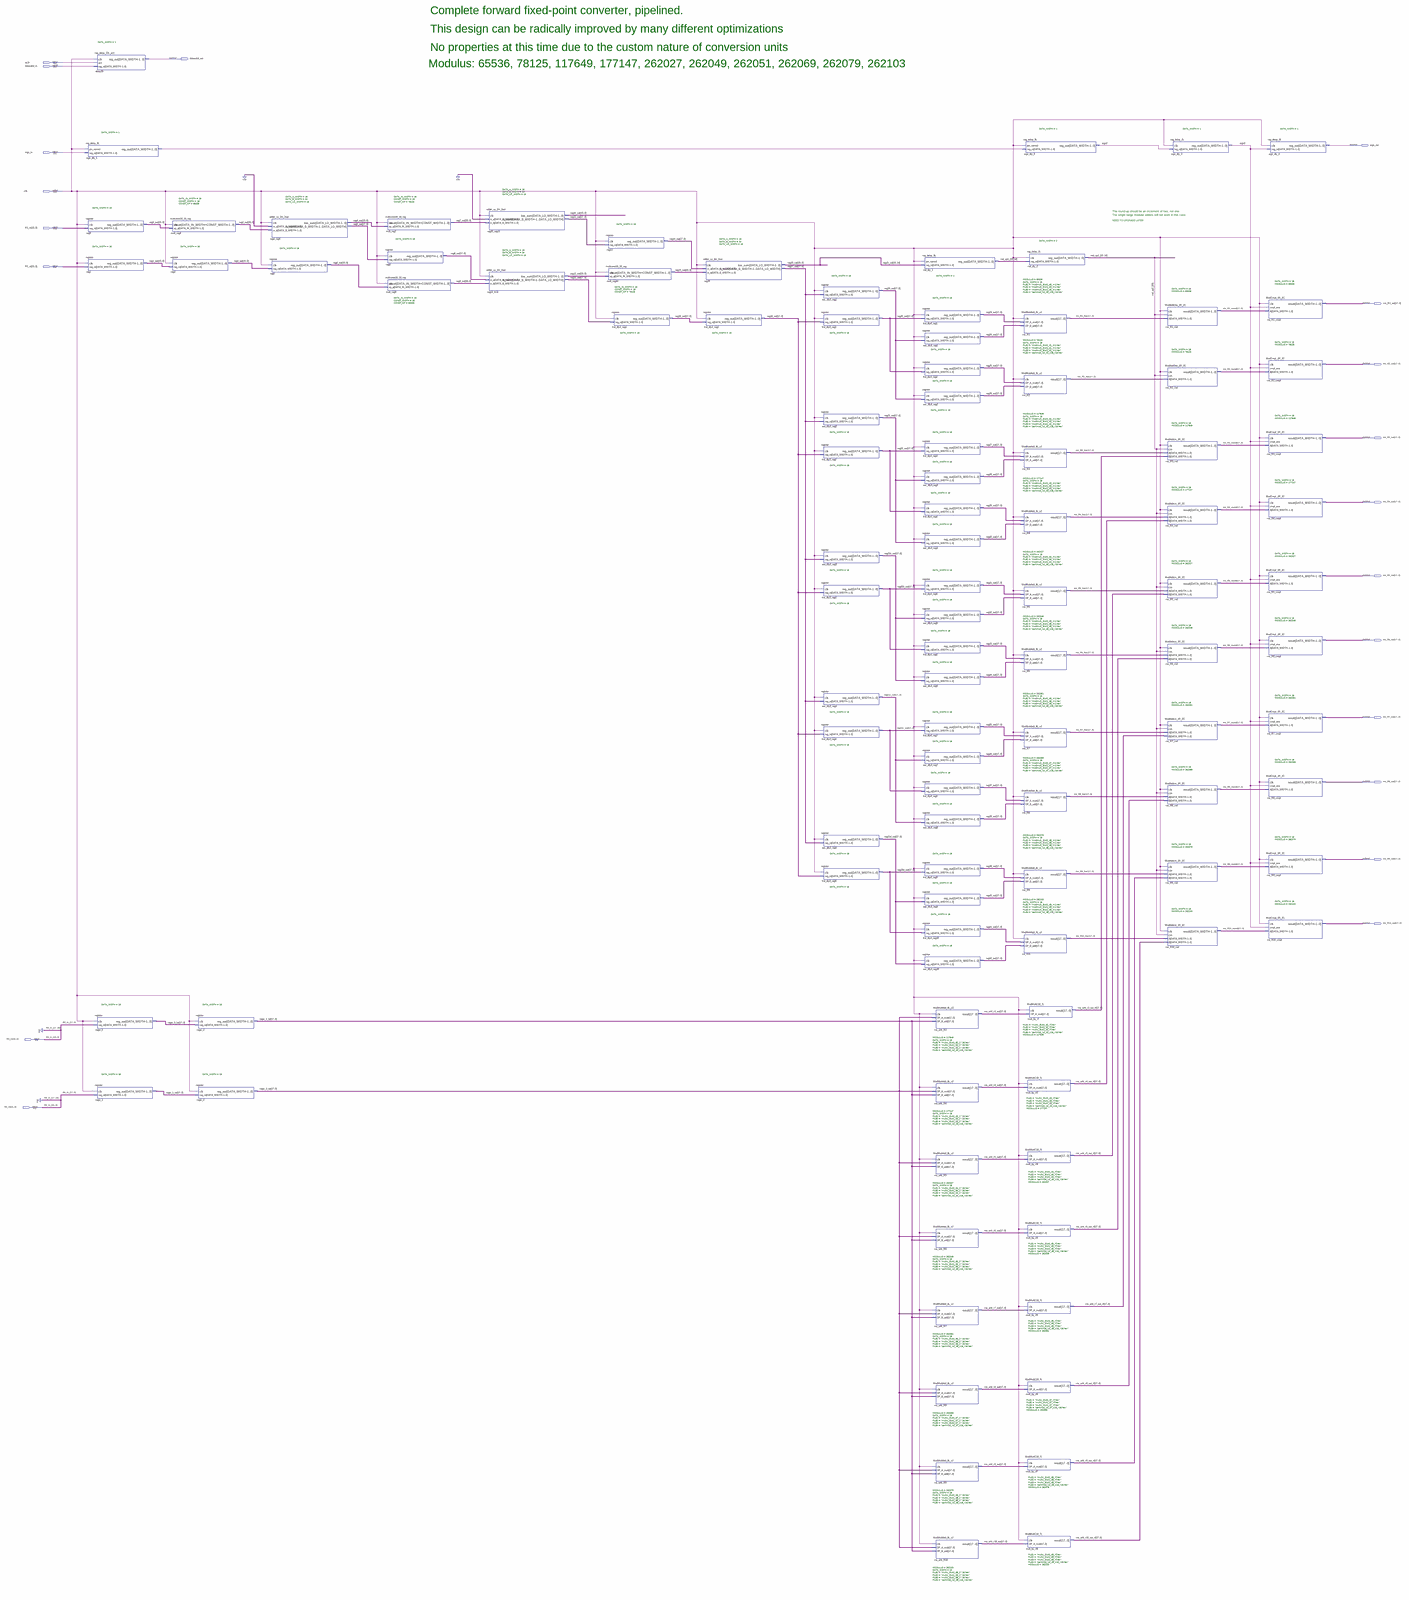
[diagram p0: schematic sheet, whole]
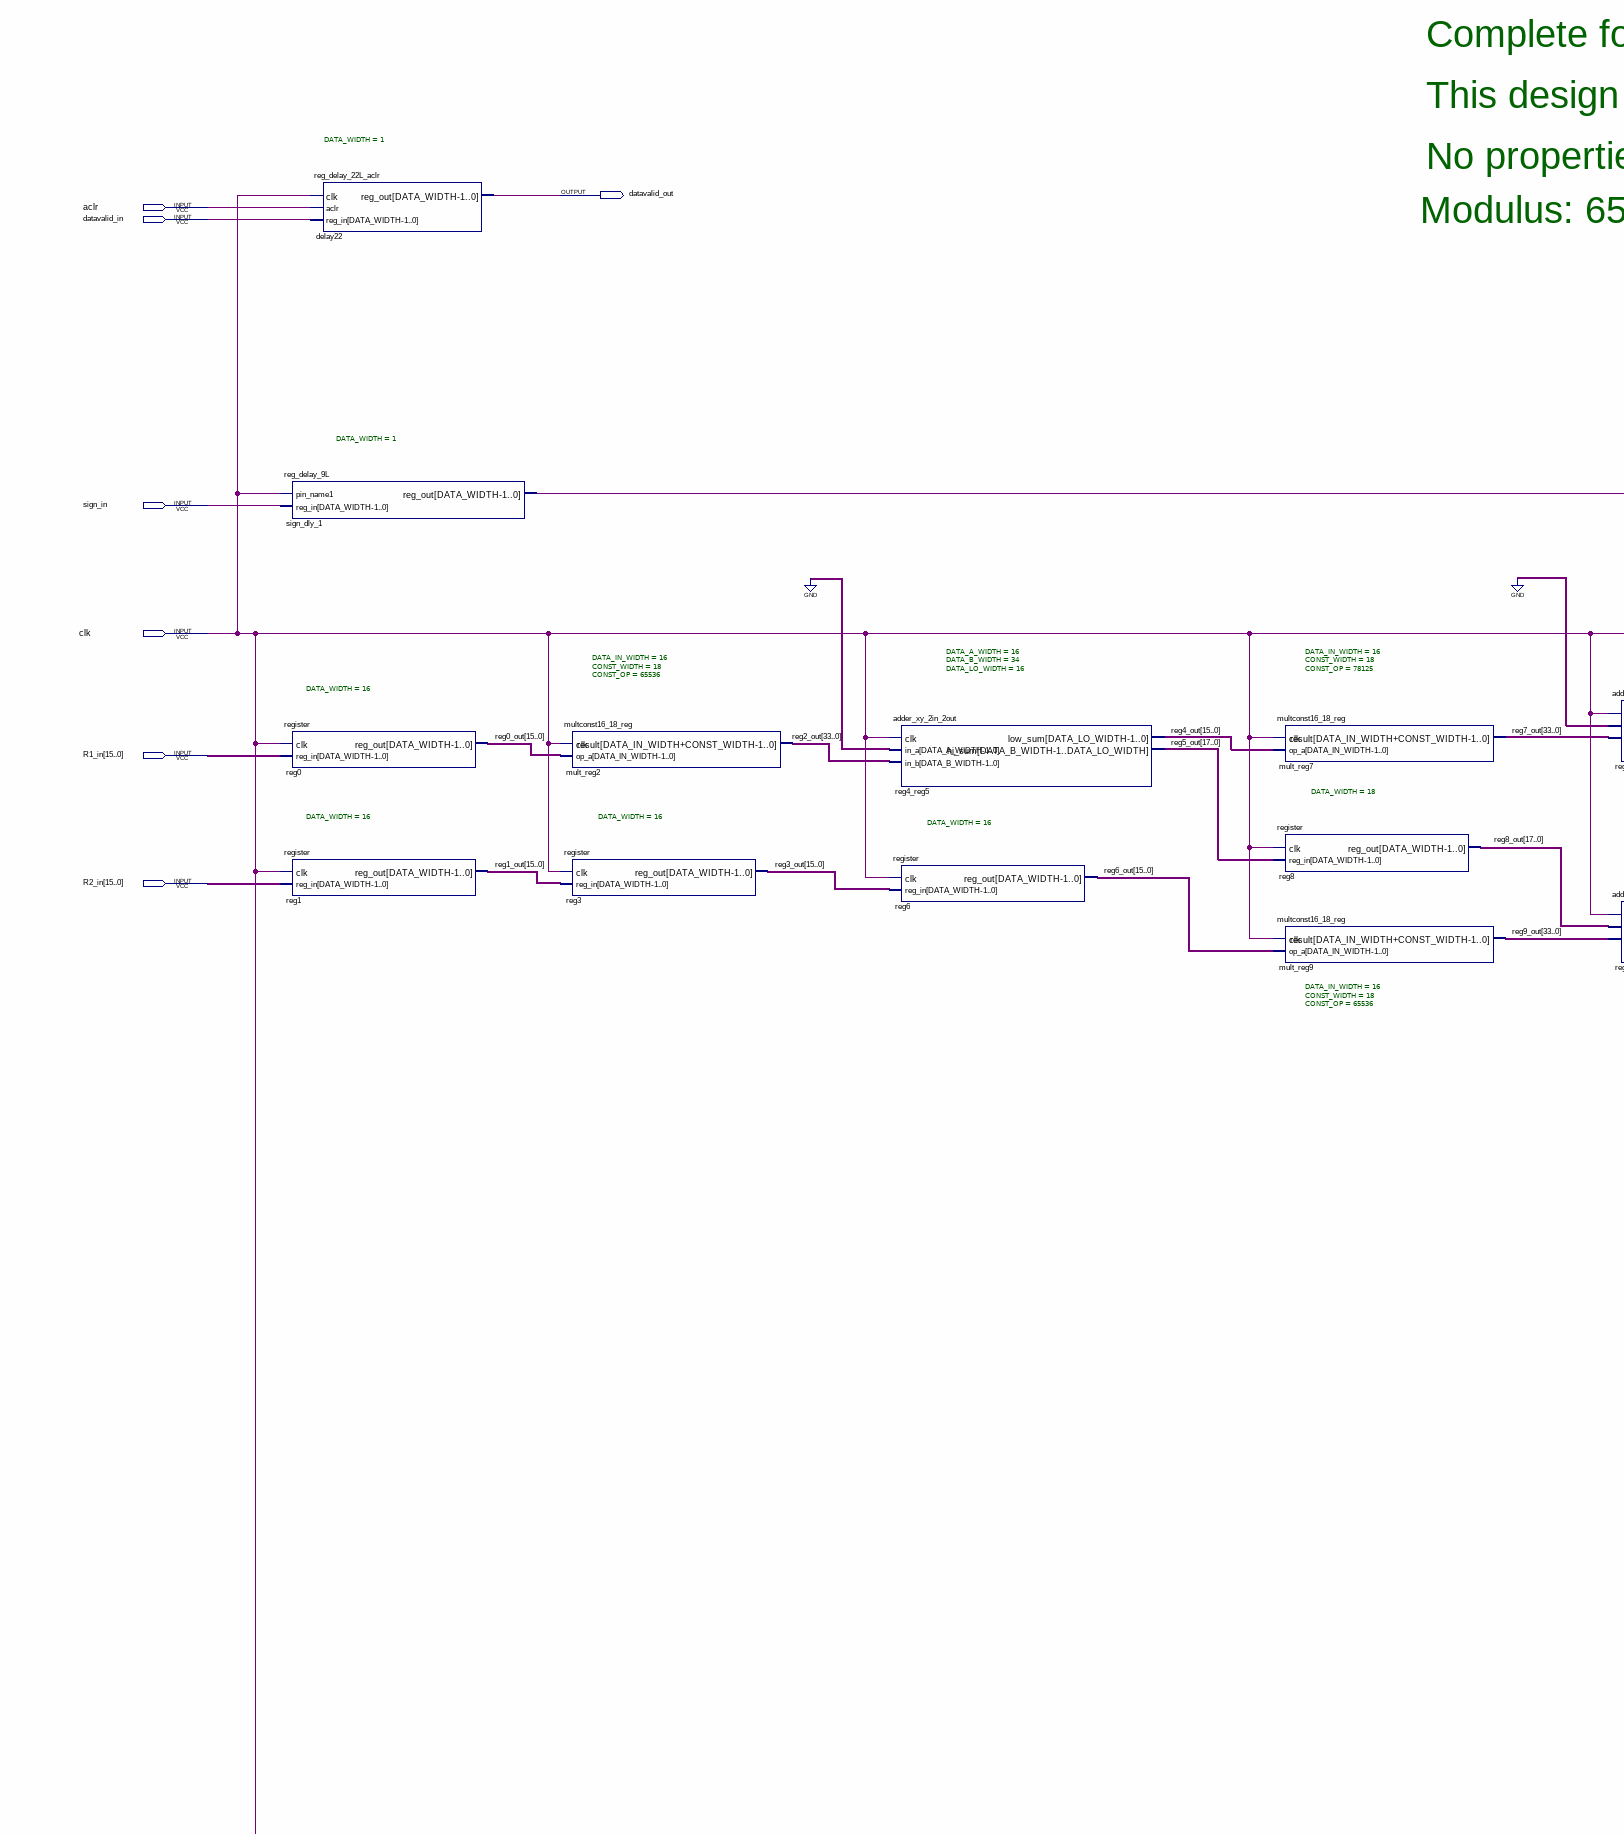
[diagram p1: schematic sheet, upper left part]
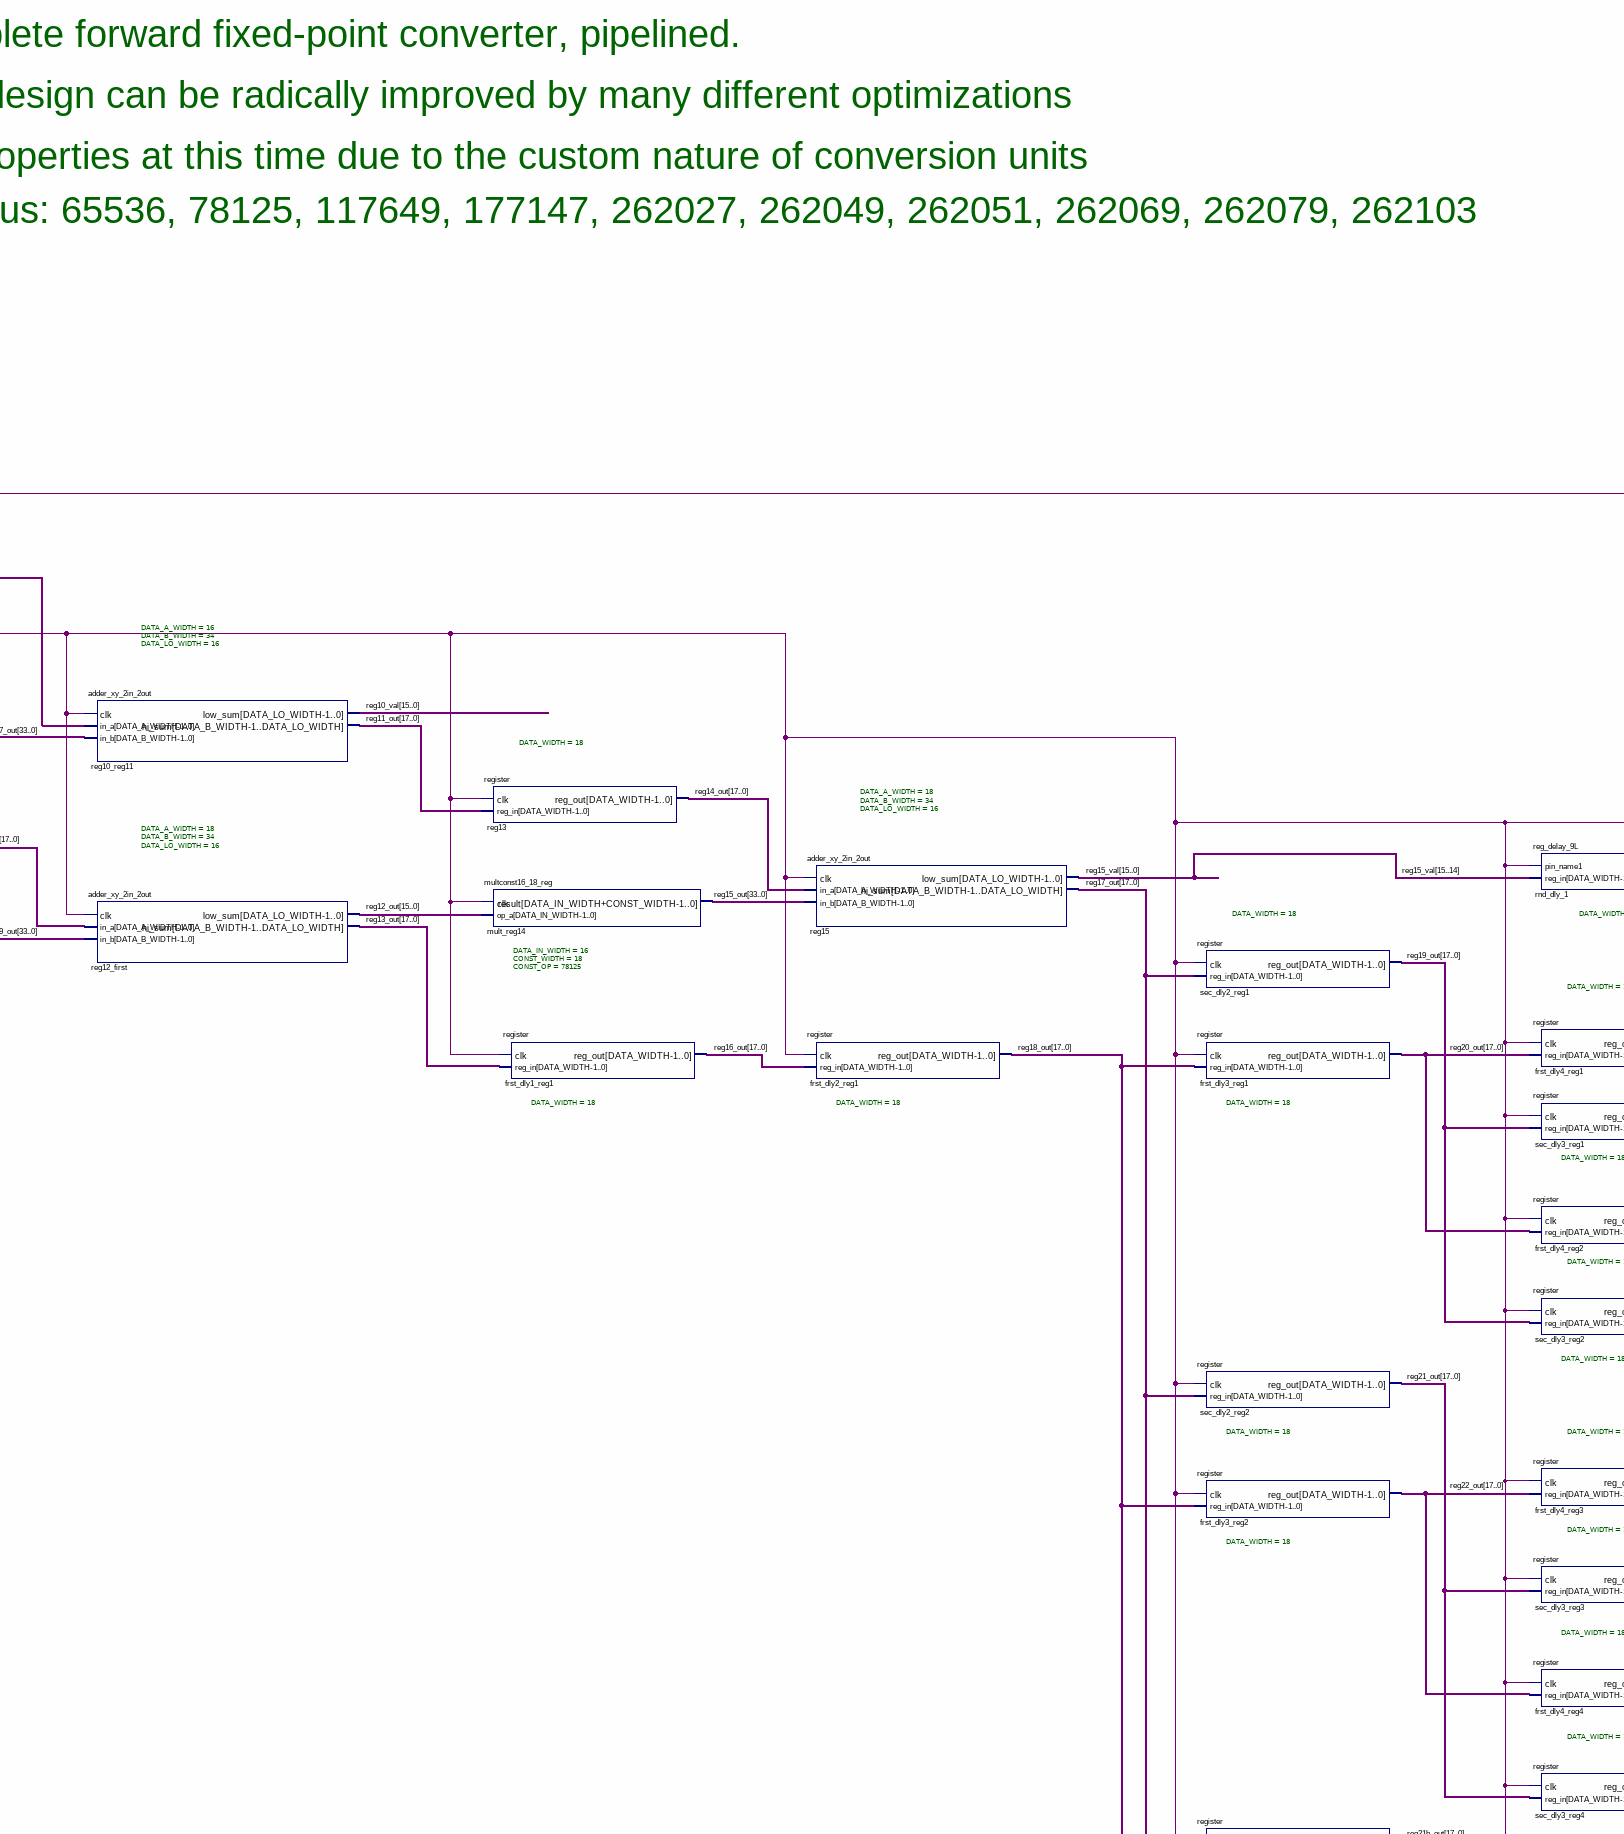
[diagram p2: schematic sheet, upper centre part]
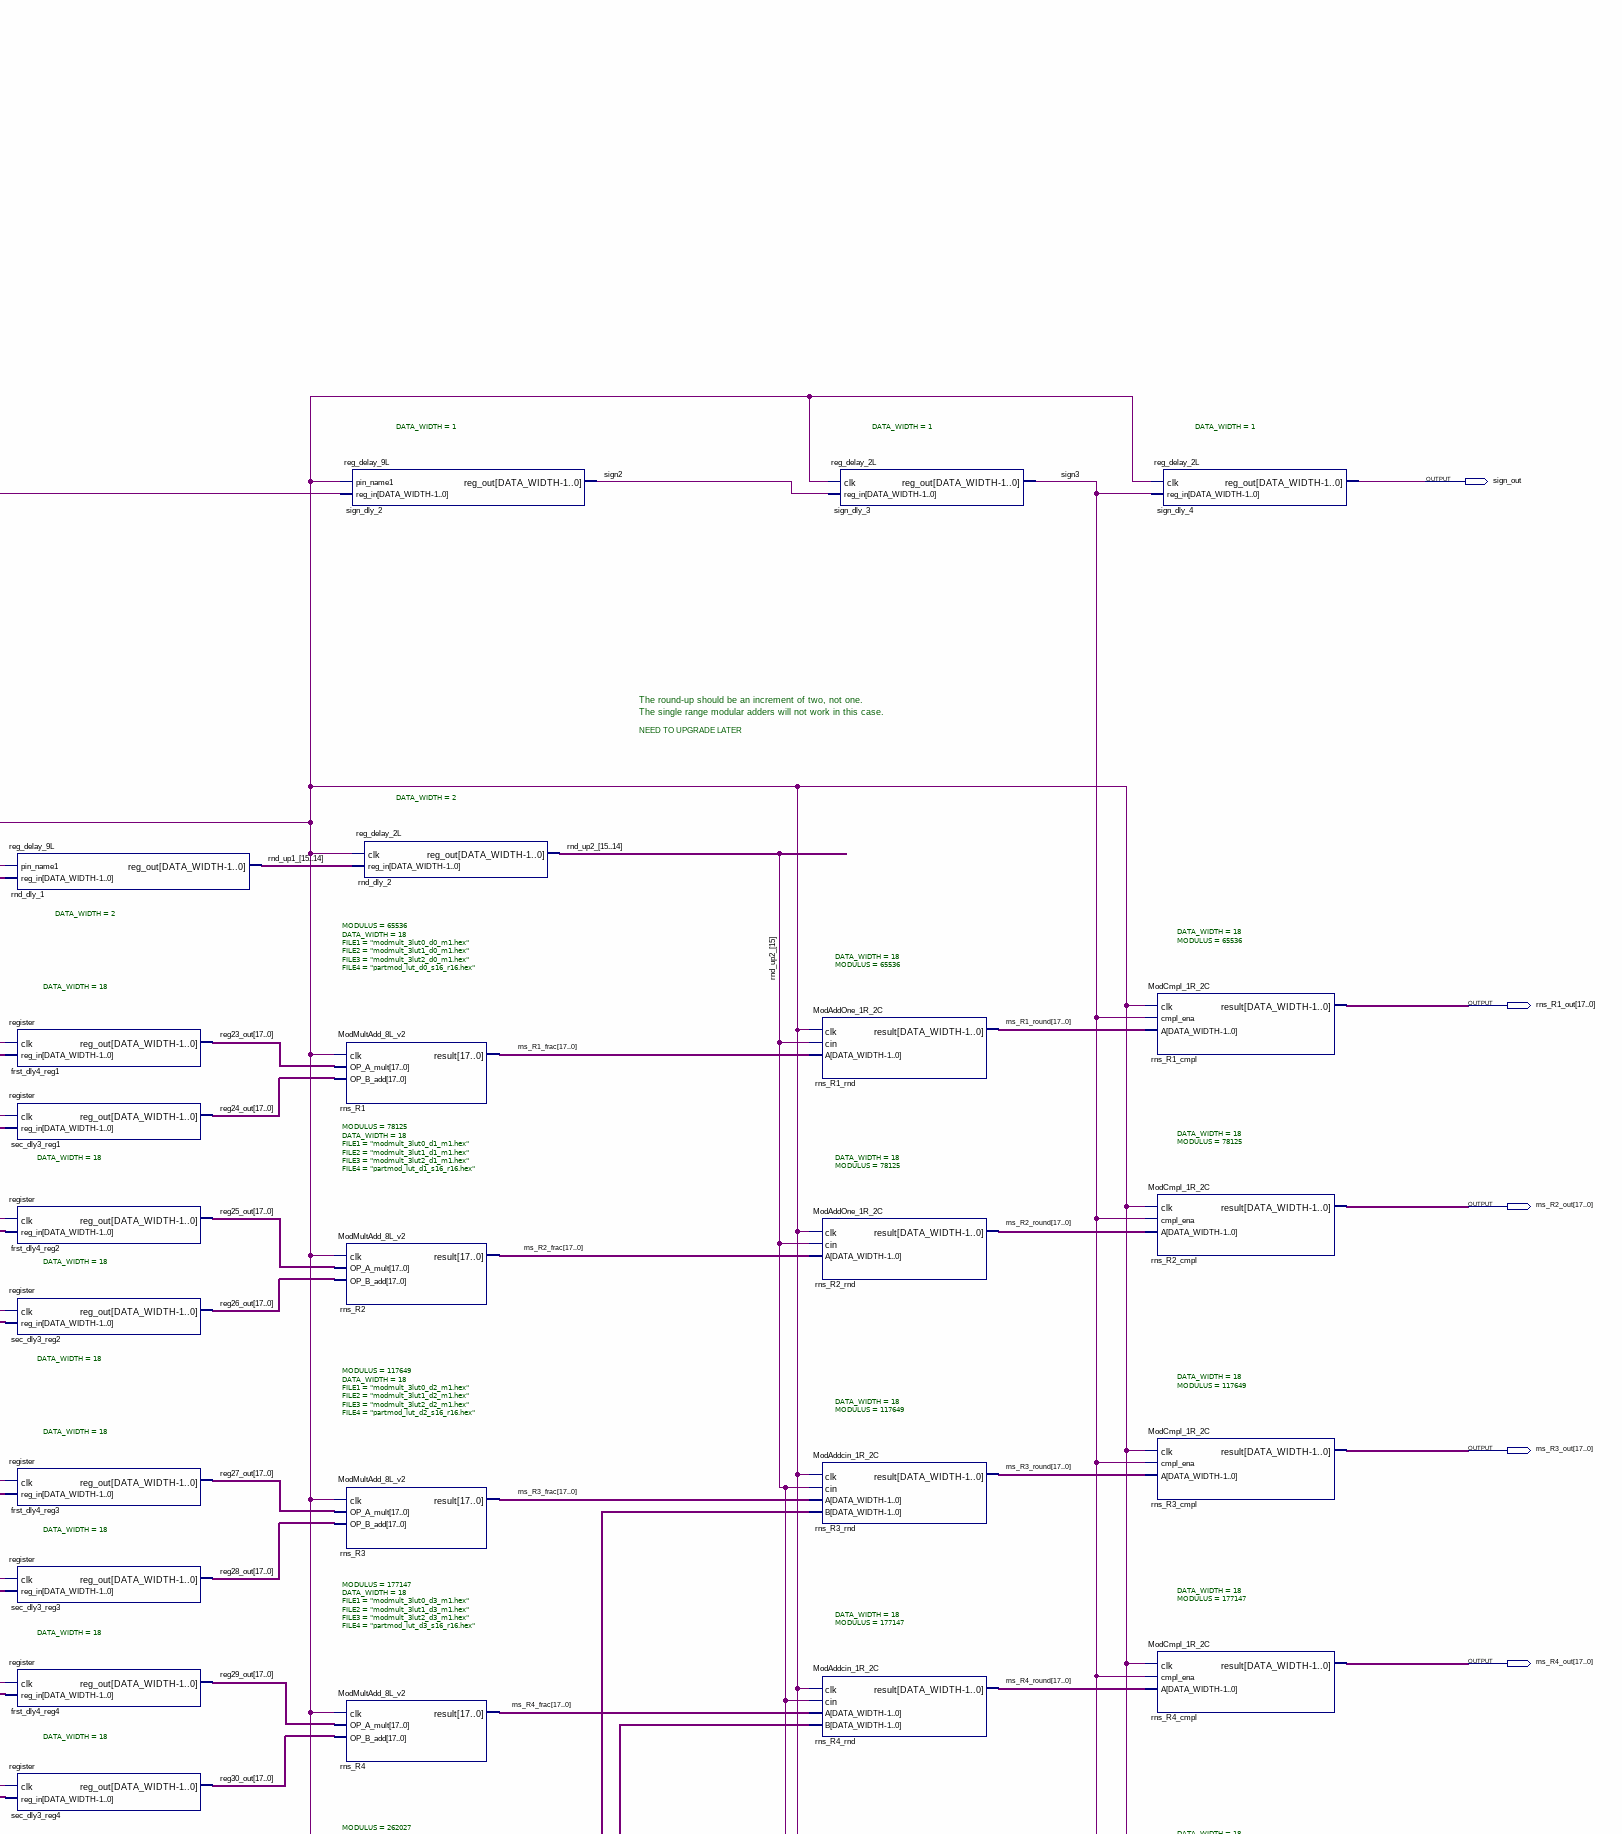
[diagram p3: schematic sheet, upper right part]
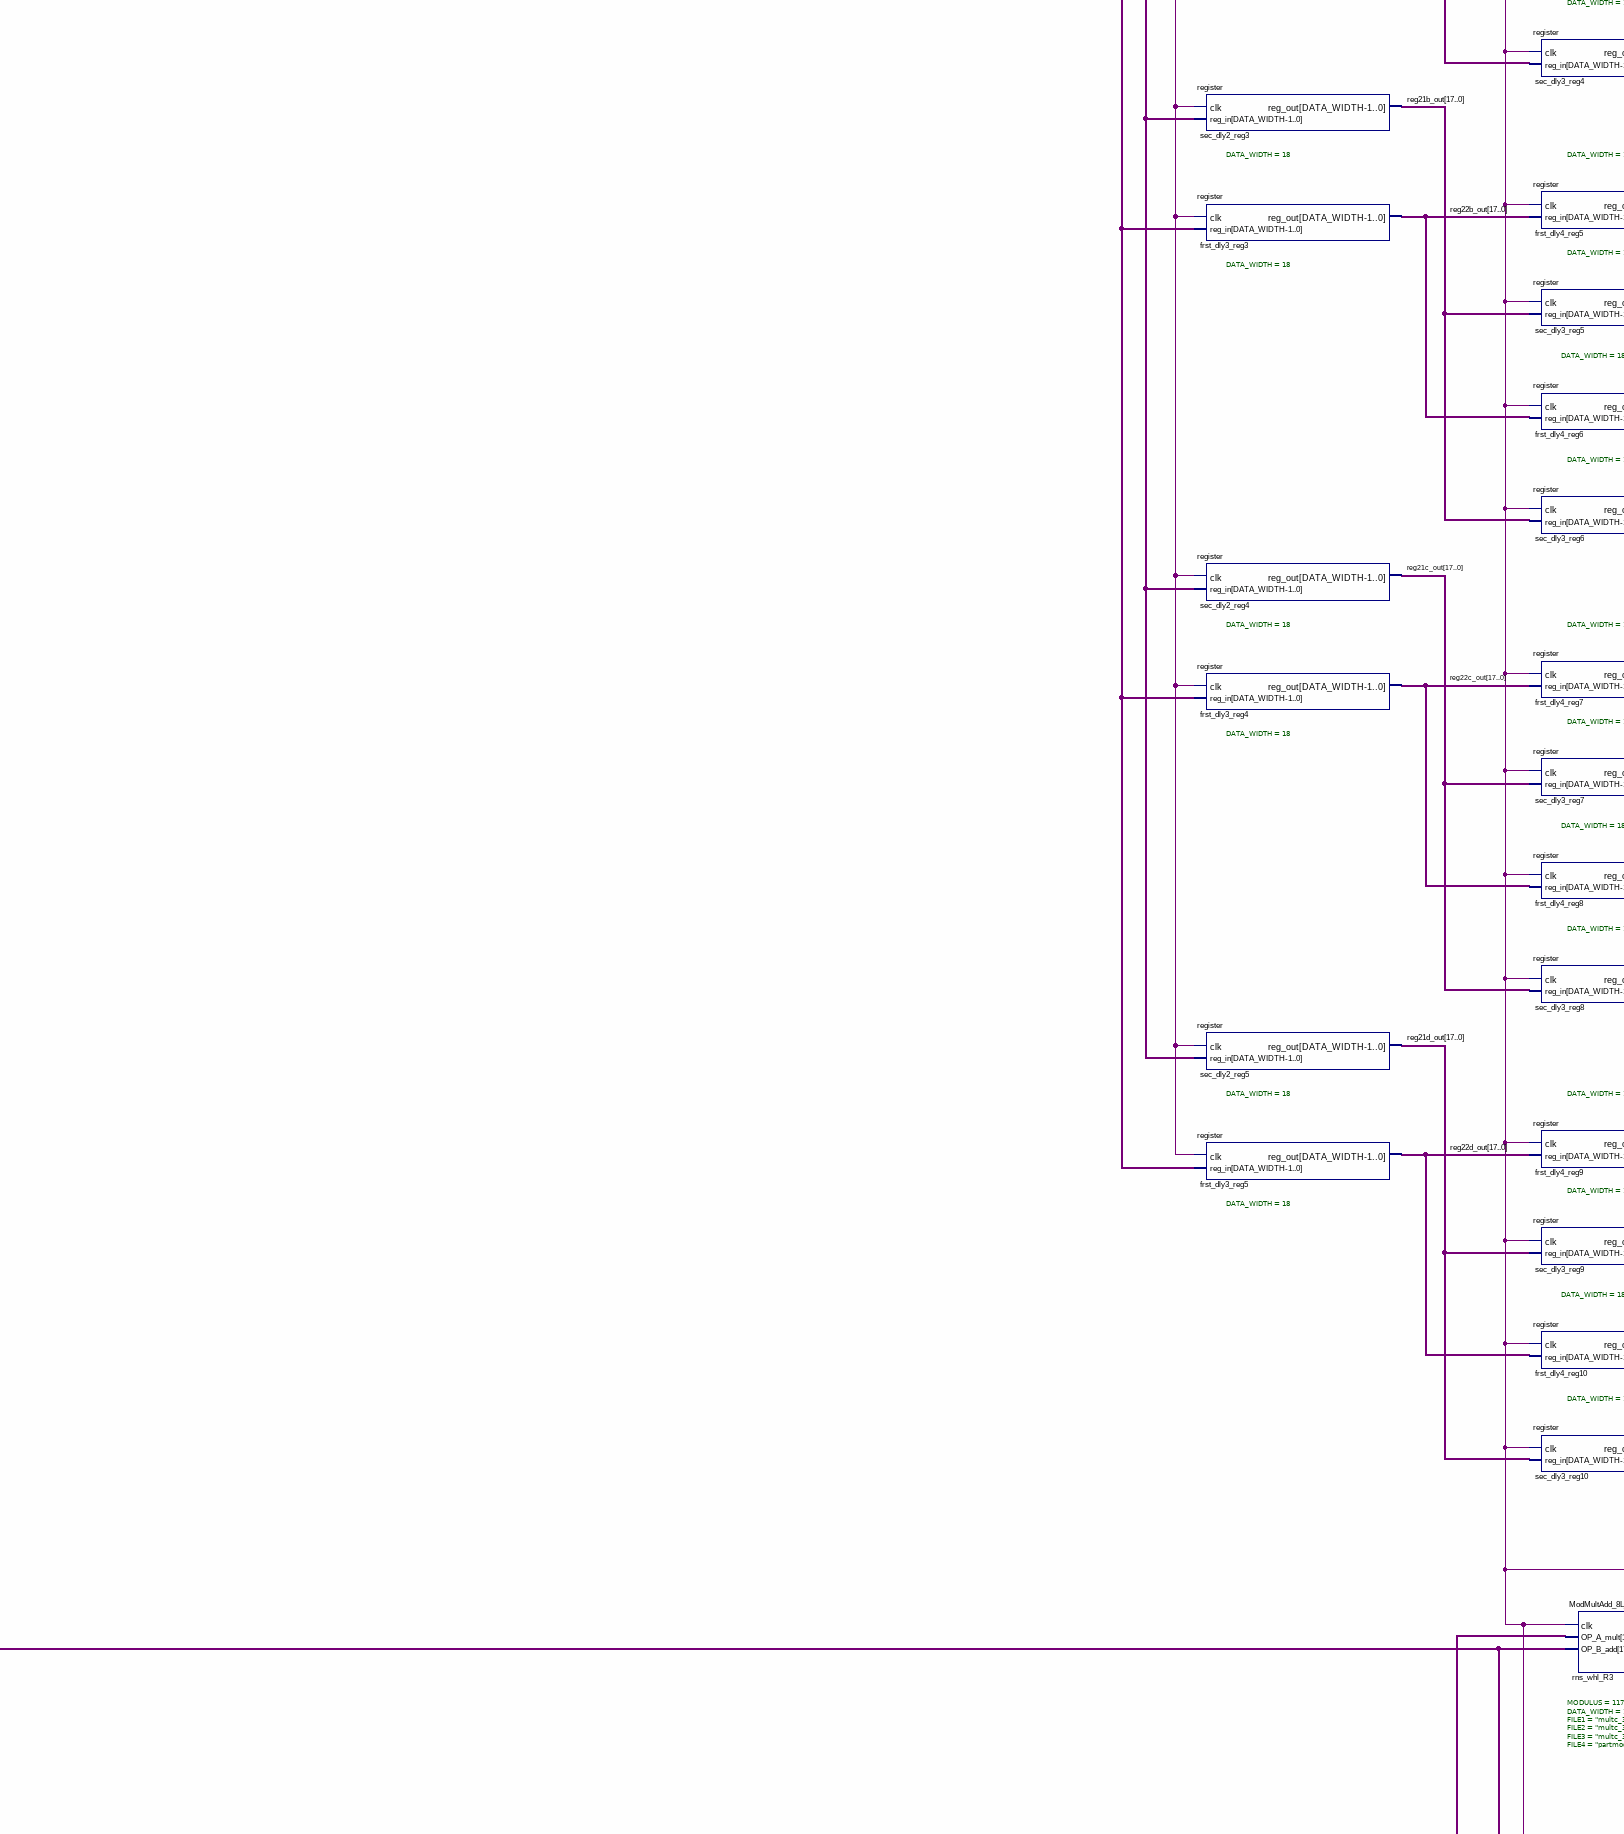
[diagram p4: schematic sheet, middle centre part]
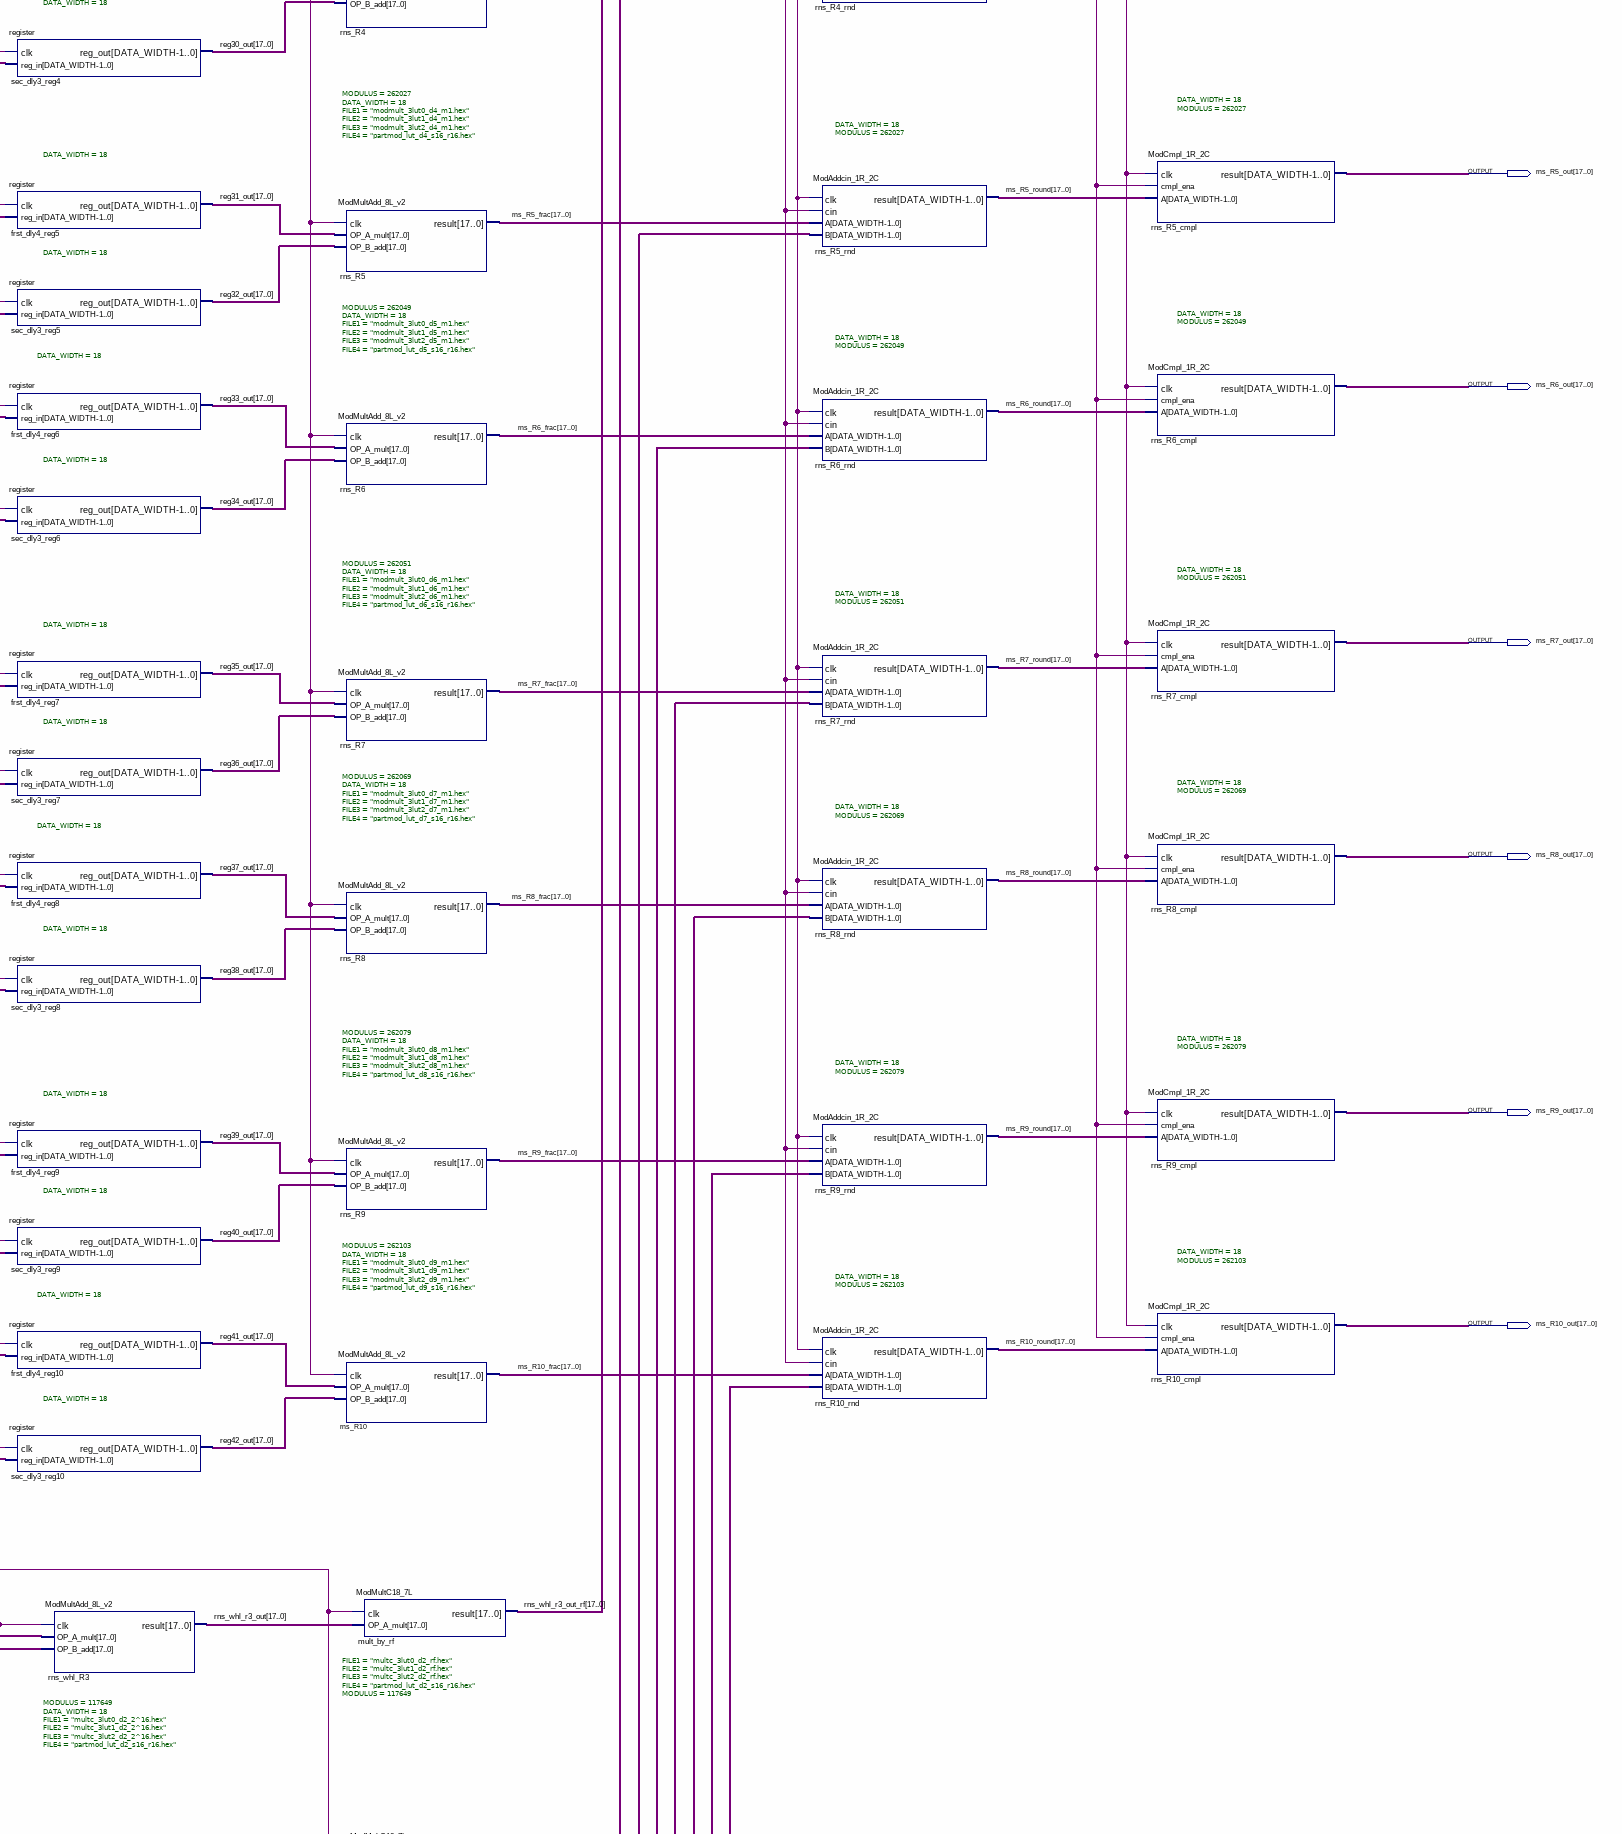
[diagram p5: schematic sheet, middle right part]
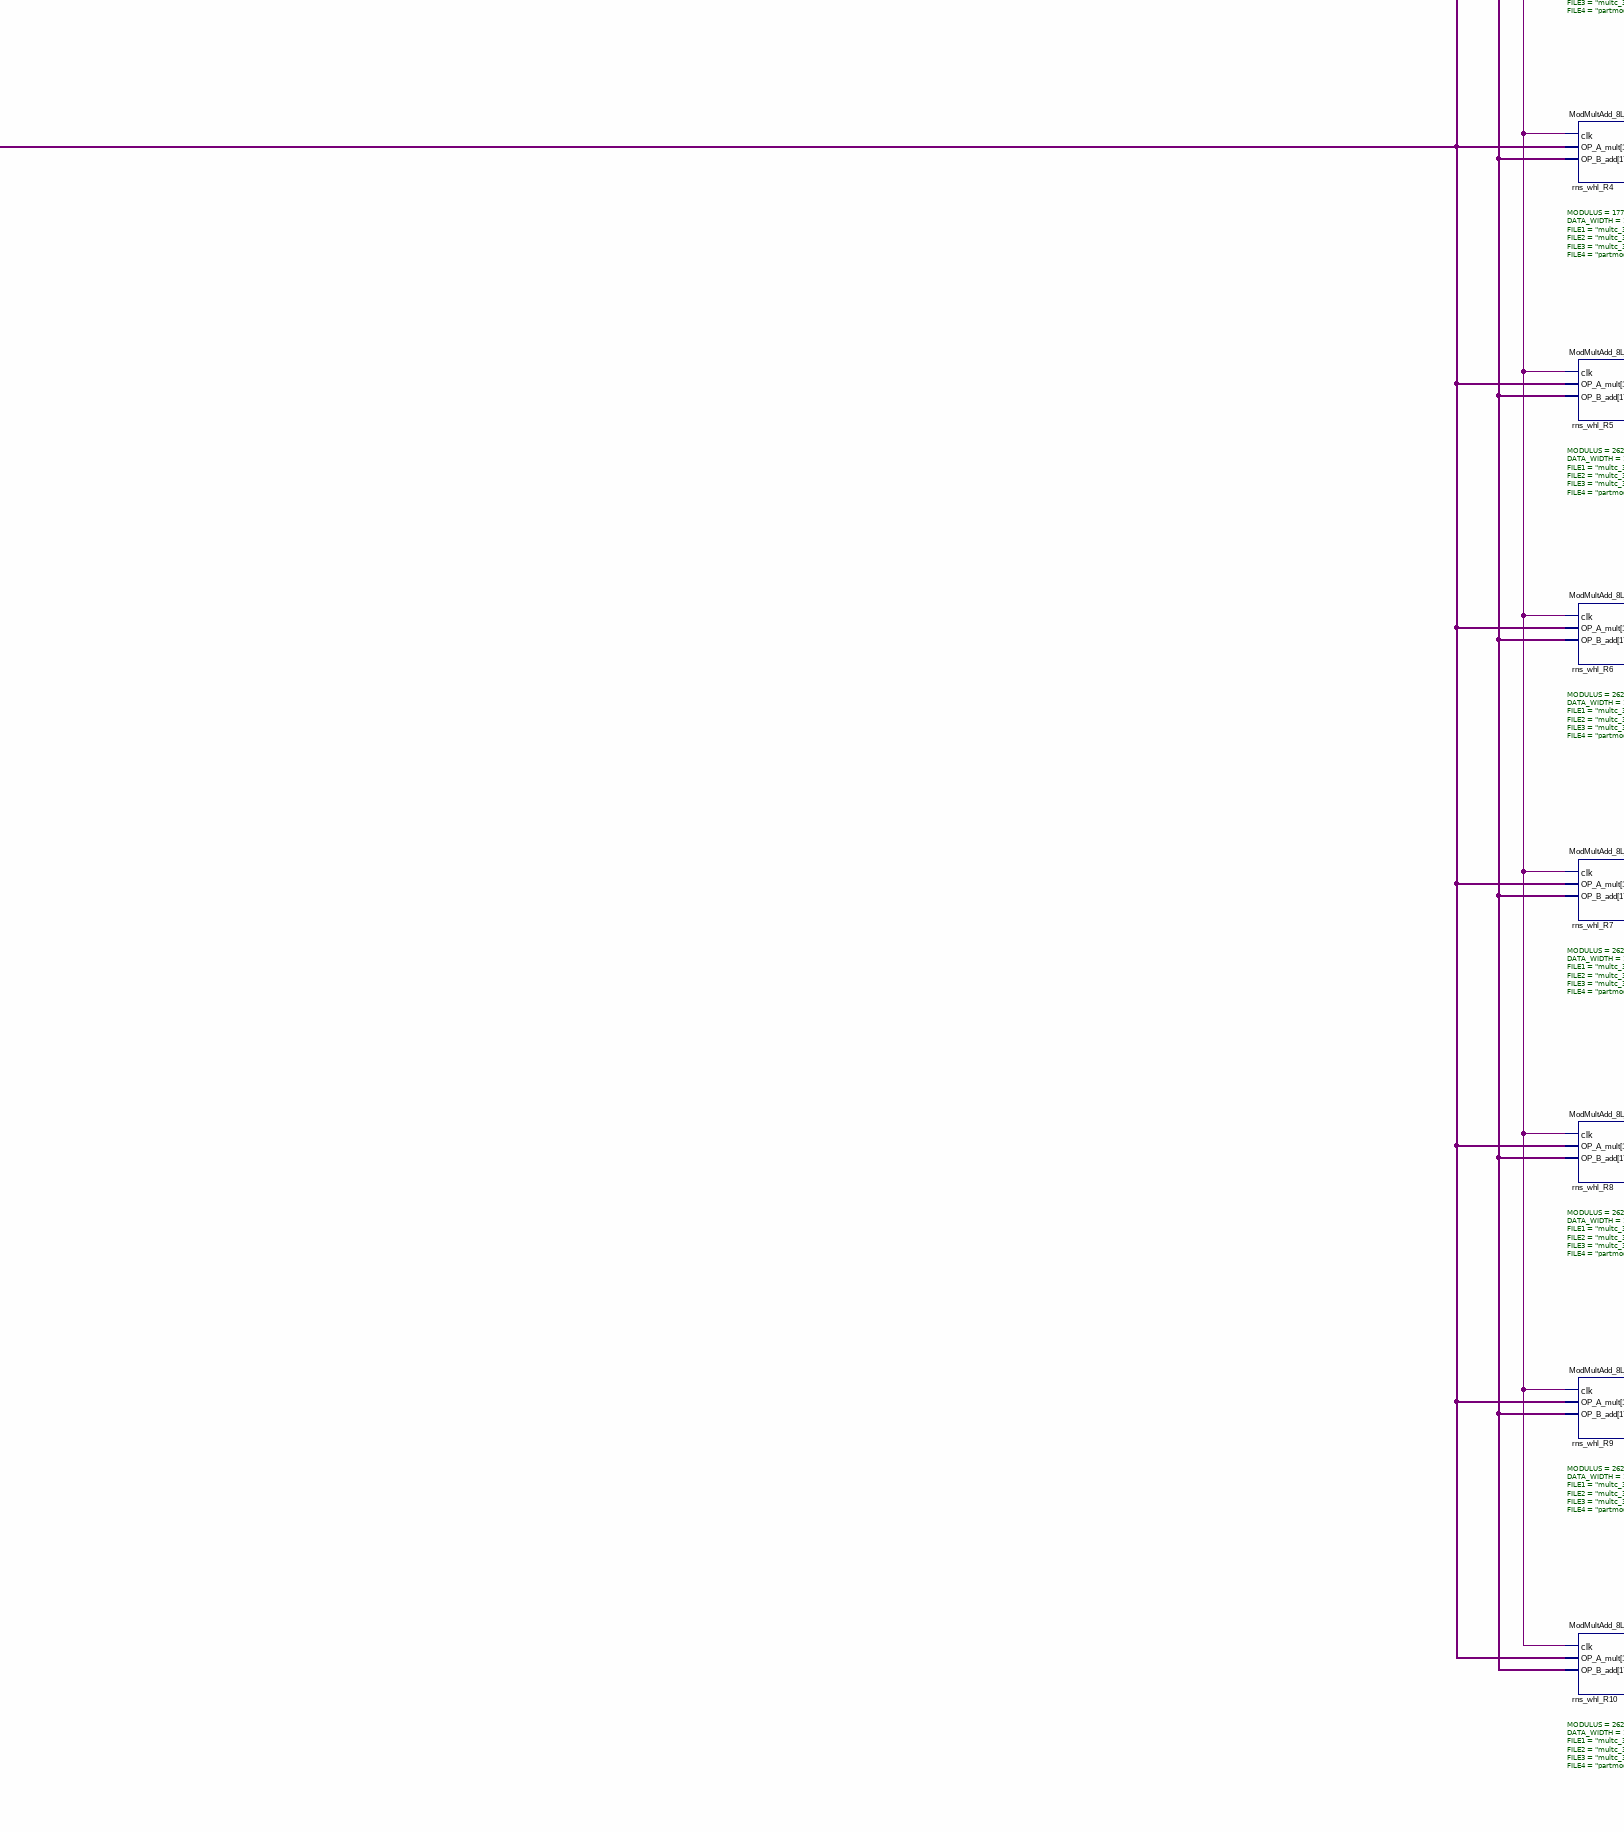
[diagram p6: schematic sheet, lower centre part]
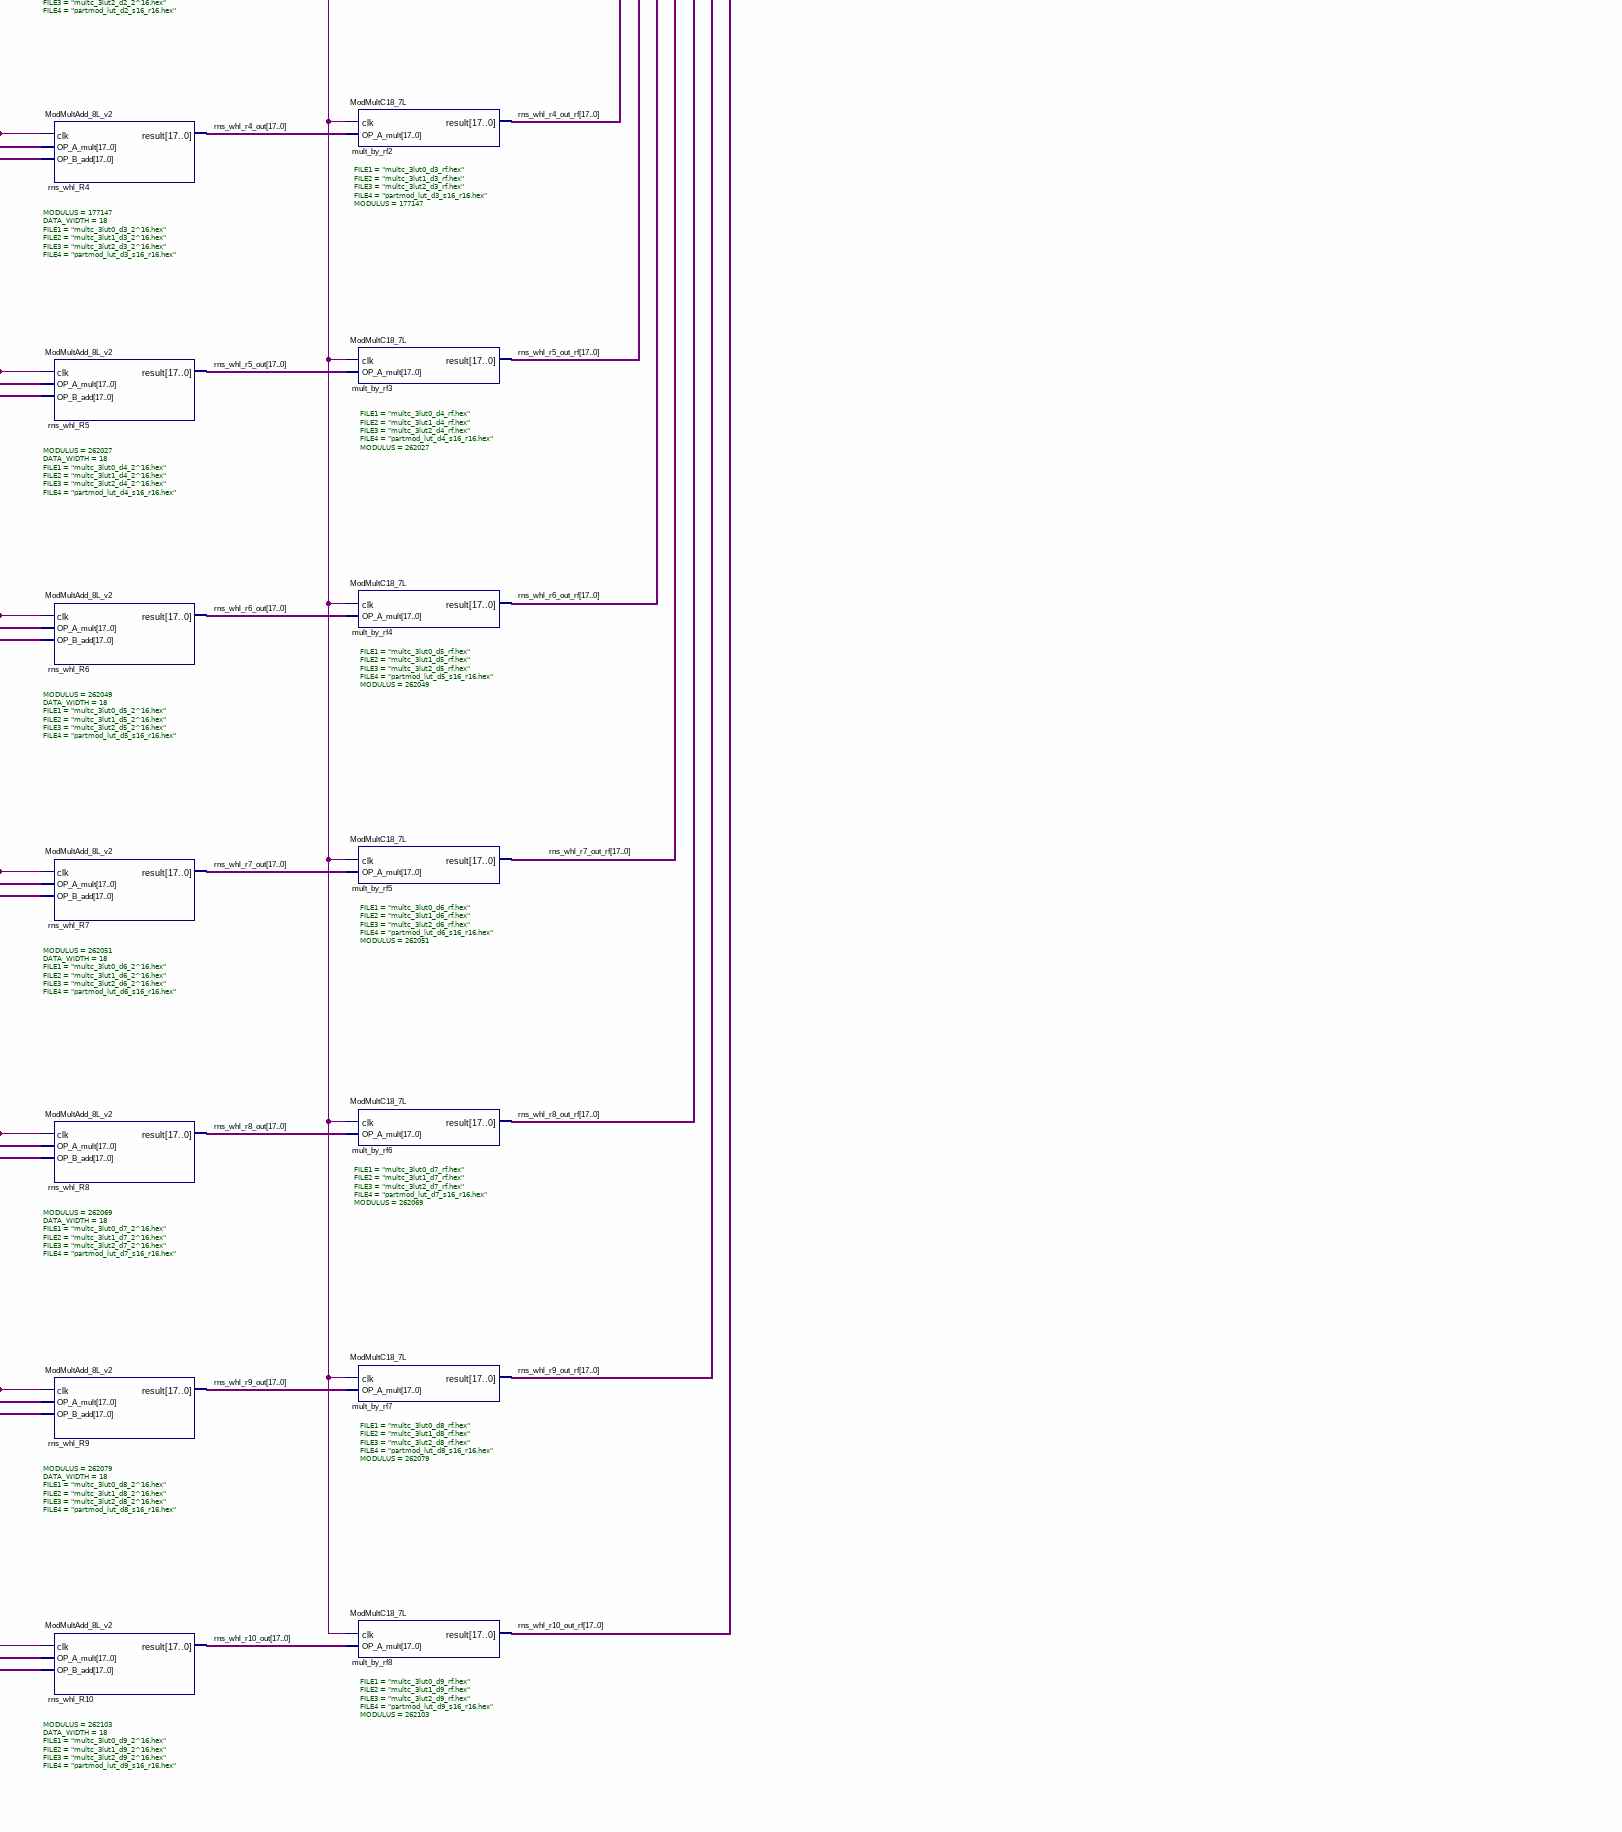
[diagram p7: schematic sheet, lower right part]
// Quartus schematic FFracConv4x16_10x18_dval.bdf as structural Verilog: 103 symbols, 20 pins
module FFracConv4x16_10x18_dval (
  input  aclr,
  input  datavalid_in,
  input  sign_in,
  input  clk,
  input  [15:0] R1_in,
  input  [15:0] R2_in,
  input  [15:0] R3_in,
  input  [15:0] R4_in,
  output datavalid_out,
  output sign_out,
  output [17:0] rns_R1_out,
  output [17:0] rns_R2_out,
  output [17:0] rns_R3_out,
  output [17:0] rns_R4_out,
  output [17:0] rns_R5_out,
  output [17:0] rns_R6_out,
  output [17:0] rns_R7_out,
  output [17:0] rns_R8_out,
  output [17:0] rns_R9_out,
  output [17:0] rns_R10_out
);

  wire sign2, sign3, sign_dly_1_reg_out;
  wire [15:0] reg0_out, reg1_out, reg3_out, reg4_out, reg6_out, reg10_val, reg12_out, reg15_val;
  wire [15:14] rnd_up1_, rnd_up2_;
  wire [17:0] reg5_out, reg8_out, reg11_out, reg13_out, reg14_out, reg16_out, reg17_out, reg18_out,
       reg19_out, reg20_out, reg21_out, reg21b_out, reg21c_out, reg21d_out, reg22_out, reg22b_out,
       reg22c_out, reg22d_out, reg23_out, reg24_out, reg25_out, reg26_out, reg27_out, reg28_out, reg29_out,
       reg30_out, reg31_out, reg32_out, reg33_out, reg34_out, reg35_out, reg36_out, reg37_out, reg38_out,
       reg39_out, reg40_out, reg41_out, reg42_out, regw_0_lat, regw_1_lat, regw_2_lat, regw_3_lat,
       rns_R1_frac, rns_R1_round, rns_R2_frac, rns_R2_round, rns_R3_frac, rns_R3_round, rns_R4_frac,
       rns_R4_round, rns_R5_frac, rns_R5_round, rns_R6_frac, rns_R6_round, rns_R7_frac, rns_R7_round,
       rns_R8_frac, rns_R8_round, rns_R9_frac, rns_R9_round, rns_R10_frac, rns_R10_round, rns_whl_r3_out,
       rns_whl_r3_out_rf, rns_whl_r4_out, rns_whl_r4_out_rf, rns_whl_r5_out, rns_whl_r5_out_rf,
       rns_whl_r6_out, rns_whl_r6_out_rf, rns_whl_r7_out, rns_whl_r7_out_rf, rns_whl_r8_out,
       rns_whl_r8_out_rf, rns_whl_r9_out, rns_whl_r9_out_rf, rns_whl_r10_out, rns_whl_r10_out_rf;
  wire [33:0] reg2_out, reg7_out, reg9_out, reg15_out;

  reg_delay_9L #(.DATA_WIDTH(1)) sign_dly_1 (.pin_name1(clk), .reg_in(sign_in), .reg_out(sign_dly_1_reg_out));
  register #(.DATA_WIDTH(16)) reg0 (.clk(clk), .reg_in(R1_in), .reg_out(reg0_out));
  register #(.DATA_WIDTH(16)) reg1 (.clk(clk), .reg_in(R2_in), .reg_out(reg1_out));
  reg_delay_22L_aclr #(.DATA_WIDTH(1)) delay22 (.clk(clk), .aclr(aclr), .reg_in(datavalid_in), .reg_out(datavalid_out));
  register #(.DATA_WIDTH(18)) regw_0 (.clk(clk), .reg_in({2'b00, R3_in}), .reg_out(regw_0_lat));
  register #(.DATA_WIDTH(18)) regw_1 (.clk(clk), .reg_in({2'b00, R4_in}), .reg_out(regw_1_lat));
  multconst16_18_reg #(.DATA_IN_WIDTH(16), .CONST_WIDTH(18), .CONST_OP(65536)) mult_reg2 (
    .clk(clk), .op_a(reg0_out), .result(reg2_out));
  register #(.DATA_WIDTH(16)) reg3 (.clk(clk), .reg_in(reg1_out), .reg_out(reg3_out));
  register #(.DATA_WIDTH(18)) regw_2 (.clk(clk), .reg_in(regw_0_lat), .reg_out(regw_2_lat));
  register #(.DATA_WIDTH(18)) regw_3 (.clk(clk), .reg_in(regw_1_lat), .reg_out(regw_3_lat));
  adder_xy_2in_2out #(.DATA_A_WIDTH(16), .DATA_B_WIDTH(34), .DATA_LO_WIDTH(16)) reg4_reg5 (
    .clk(clk), .in_a({16{1'b0}}), .in_b(reg2_out), .low_sum(reg4_out), .hi_sum(reg5_out));
  register #(.DATA_WIDTH(16)) reg6 (.clk(clk), .reg_in(reg3_out), .reg_out(reg6_out));
  multconst16_18_reg #(.DATA_IN_WIDTH(16), .CONST_WIDTH(18), .CONST_OP(78125)) mult_reg7 (
    .clk(clk), .op_a(reg4_out), .result(reg7_out));
  register #(.DATA_WIDTH(18)) reg8 (.clk(clk), .reg_in(reg5_out), .reg_out(reg8_out));
  multconst16_18_reg #(.DATA_IN_WIDTH(16), .CONST_WIDTH(18), .CONST_OP(65536)) mult_reg9 (
    .clk(clk), .op_a(reg6_out), .result(reg9_out));
  adder_xy_2in_2out #(.DATA_A_WIDTH(16), .DATA_B_WIDTH(34), .DATA_LO_WIDTH(16)) reg10_reg11 (
    .clk(clk), .in_a({16{1'b0}}), .in_b(reg7_out), .low_sum(reg10_val), .hi_sum(reg11_out));
  adder_xy_2in_2out #(.DATA_A_WIDTH(18), .DATA_B_WIDTH(34), .DATA_LO_WIDTH(16)) reg12_first (
    .clk(clk), .in_a(reg8_out), .in_b(reg9_out), .low_sum(reg12_out), .hi_sum(reg13_out));
  register #(.DATA_WIDTH(18)) reg13 (.clk(clk), .reg_in(reg11_out), .reg_out(reg14_out));
  multconst16_18_reg #(.DATA_IN_WIDTH(16), .CONST_WIDTH(18), .CONST_OP(78125)) mult_reg14 (
    .clk(clk), .op_a(reg12_out), .result(reg15_out));
  register #(.DATA_WIDTH(18)) frst_dly1_reg1 (.clk(clk), .reg_in(reg13_out), .reg_out(reg16_out));
  adder_xy_2in_2out #(.DATA_A_WIDTH(18), .DATA_B_WIDTH(34), .DATA_LO_WIDTH(16)) reg15 (
    .clk(clk), .in_a(reg14_out), .in_b(reg15_out), .low_sum(reg15_val), .hi_sum(reg17_out));
  register #(.DATA_WIDTH(18)) frst_dly2_reg1 (.clk(clk), .reg_in(reg16_out), .reg_out(reg18_out));
  register #(.DATA_WIDTH(18)) sec_dly2_reg1 (.clk(clk), .reg_in(reg17_out), .reg_out(reg19_out));
  register #(.DATA_WIDTH(18)) frst_dly3_reg1 (.clk(clk), .reg_in(reg18_out), .reg_out(reg20_out));
  register #(.DATA_WIDTH(18)) sec_dly2_reg2 (.clk(clk), .reg_in(reg17_out), .reg_out(reg21_out));
  register #(.DATA_WIDTH(18)) frst_dly3_reg2 (.clk(clk), .reg_in(reg18_out), .reg_out(reg22_out));
  register #(.DATA_WIDTH(18)) sec_dly2_reg3 (.clk(clk), .reg_in(reg17_out), .reg_out(reg21b_out));
  register #(.DATA_WIDTH(18)) frst_dly3_reg3 (.clk(clk), .reg_in(reg18_out), .reg_out(reg22b_out));
  register #(.DATA_WIDTH(18)) sec_dly2_reg4 (.clk(clk), .reg_in(reg17_out), .reg_out(reg21c_out));
  register #(.DATA_WIDTH(18)) frst_dly3_reg4 (.clk(clk), .reg_in(reg18_out), .reg_out(reg22c_out));
  register #(.DATA_WIDTH(18)) sec_dly2_reg5 (.clk(clk), .reg_in(reg17_out), .reg_out(reg21d_out));
  register #(.DATA_WIDTH(18)) frst_dly3_reg5 (.clk(clk), .reg_in(reg18_out), .reg_out(reg22d_out));
  reg_delay_9L #(.DATA_WIDTH(2)) rnd_dly_1 (.pin_name1(clk), .reg_in(reg15_val[15:14]), .reg_out(rnd_up1_));
  register #(.DATA_WIDTH(18)) frst_dly4_reg1 (.clk(clk), .reg_in(reg20_out), .reg_out(reg23_out));
  register #(.DATA_WIDTH(18)) sec_dly3_reg1 (.clk(clk), .reg_in(reg19_out), .reg_out(reg24_out));
  register #(.DATA_WIDTH(18)) frst_dly4_reg2 (.clk(clk), .reg_in(reg20_out), .reg_out(reg25_out));
  register #(.DATA_WIDTH(18)) sec_dly3_reg2 (.clk(clk), .reg_in(reg19_out), .reg_out(reg26_out));
  register #(.DATA_WIDTH(18)) frst_dly4_reg3 (.clk(clk), .reg_in(reg22_out), .reg_out(reg27_out));
  register #(.DATA_WIDTH(18)) sec_dly3_reg3 (.clk(clk), .reg_in(reg21_out), .reg_out(reg28_out));
  register #(.DATA_WIDTH(18)) frst_dly4_reg4 (.clk(clk), .reg_in(reg22_out), .reg_out(reg29_out));
  register #(.DATA_WIDTH(18)) sec_dly3_reg4 (.clk(clk), .reg_in(reg21_out), .reg_out(reg30_out));
  register #(.DATA_WIDTH(18)) frst_dly4_reg5 (.clk(clk), .reg_in(reg22b_out), .reg_out(reg31_out));
  register #(.DATA_WIDTH(18)) sec_dly3_reg5 (.clk(clk), .reg_in(reg21b_out), .reg_out(reg32_out));
  register #(.DATA_WIDTH(18)) frst_dly4_reg6 (.clk(clk), .reg_in(reg22b_out), .reg_out(reg33_out));
  register #(.DATA_WIDTH(18)) sec_dly3_reg6 (.clk(clk), .reg_in(reg21b_out), .reg_out(reg34_out));
  register #(.DATA_WIDTH(18)) frst_dly4_reg7 (.clk(clk), .reg_in(reg22c_out), .reg_out(reg35_out));
  register #(.DATA_WIDTH(18)) sec_dly3_reg7 (.clk(clk), .reg_in(reg21c_out), .reg_out(reg36_out));
  register #(.DATA_WIDTH(18)) frst_dly4_reg8 (.clk(clk), .reg_in(reg22c_out), .reg_out(reg37_out));
  register #(.DATA_WIDTH(18)) sec_dly3_reg8 (.clk(clk), .reg_in(reg21c_out), .reg_out(reg38_out));
  register #(.DATA_WIDTH(18)) frst_dly4_reg9 (.clk(clk), .reg_in(reg22d_out), .reg_out(reg39_out));
  register #(.DATA_WIDTH(18)) sec_dly3_reg9 (.clk(clk), .reg_in(reg21d_out), .reg_out(reg40_out));
  register #(.DATA_WIDTH(18)) frst_dly4_reg10 (.clk(clk), .reg_in(reg22d_out), .reg_out(reg41_out));
  register #(.DATA_WIDTH(18)) sec_dly3_reg10 (.clk(clk), .reg_in(reg21d_out), .reg_out(reg42_out));
  ModMultAdd_8L_v2 #(.MODULUS(117649), .DATA_WIDTH(18), .FILE1("multc_3lut0_d2_2^16.hex"), .FILE2("multc_3lut1_d2_2^16.hex"), .FILE3("multc_3lut2_d2_2^16.hex"), .FILE4("partmod_lut_d2_s16_r16.hex")) rns_whl_R3 (
    .clk(clk), .OP_A_mult(regw_3_lat), .OP_B_add(regw_2_lat), .result(rns_whl_r3_out));
  ModMultAdd_8L_v2 #(.MODULUS(177147), .DATA_WIDTH(18), .FILE1("multc_3lut0_d3_2^16.hex"), .FILE2("multc_3lut1_d3_2^16.hex"), .FILE3("multc_3lut2_d3_2^16.hex"), .FILE4("partmod_lut_d3_s16_r16.hex")) rns_whl_R4 (
    .clk(clk), .OP_A_mult(regw_3_lat), .OP_B_add(regw_2_lat), .result(rns_whl_r4_out));
  ModMultAdd_8L_v2 #(.MODULUS(262027), .DATA_WIDTH(18), .FILE1("multc_3lut0_d4_2^16.hex"), .FILE2("multc_3lut1_d4_2^16.hex"), .FILE3("multc_3lut2_d4_2^16.hex"), .FILE4("partmod_lut_d4_s16_r16.hex")) rns_whl_R5 (
    .clk(clk), .OP_A_mult(regw_3_lat), .OP_B_add(regw_2_lat), .result(rns_whl_r5_out));
  ModMultAdd_8L_v2 #(.MODULUS(262049), .DATA_WIDTH(18), .FILE1("multc_3lut0_d5_2^16.hex"), .FILE2("multc_3lut1_d5_2^16.hex"), .FILE3("multc_3lut2_d5_2^16.hex"), .FILE4("partmod_lut_d5_s16_r16.hex")) rns_whl_R6 (
    .clk(clk), .OP_A_mult(regw_3_lat), .OP_B_add(regw_2_lat), .result(rns_whl_r6_out));
  ModMultAdd_8L_v2 #(.MODULUS(262051), .DATA_WIDTH(18), .FILE1("multc_3lut0_d6_2^16.hex"), .FILE2("multc_3lut1_d6_2^16.hex"), .FILE3("multc_3lut2_d6_2^16.hex"), .FILE4("partmod_lut_d6_s16_r16.hex")) rns_whl_R7 (
    .clk(clk), .OP_A_mult(regw_3_lat), .OP_B_add(regw_2_lat), .result(rns_whl_r7_out));
  ModMultAdd_8L_v2 #(.MODULUS(262069), .DATA_WIDTH(18), .FILE1("multc_3lut0_d7_2^16.hex"), .FILE2("multc_3lut1_d7_2^16.hex"), .FILE3("multc_3lut2_d7_2^16.hex"), .FILE4("partmod_lut_d7_s16_r16.hex")) rns_whl_R8 (
    .clk(clk), .OP_A_mult(regw_3_lat), .OP_B_add(regw_2_lat), .result(rns_whl_r8_out));
  ModMultAdd_8L_v2 #(.MODULUS(262079), .DATA_WIDTH(18), .FILE1("multc_3lut0_d8_2^16.hex"), .FILE2("multc_3lut1_d8_2^16.hex"), .FILE3("multc_3lut2_d8_2^16.hex"), .FILE4("partmod_lut_d8_s16_r16.hex")) rns_whl_R9 (
    .clk(clk), .OP_A_mult(regw_3_lat), .OP_B_add(regw_2_lat), .result(rns_whl_r9_out));
  ModMultAdd_8L_v2 #(.MODULUS(262103), .DATA_WIDTH(18), .FILE1("multc_3lut0_d9_2^16.hex"), .FILE2("multc_3lut1_d9_2^16.hex"), .FILE3("multc_3lut2_d9_2^16.hex"), .FILE4("partmod_lut_d9_s16_r16.hex")) rns_whl_R10 (
    .clk(clk), .OP_A_mult(regw_3_lat), .OP_B_add(regw_2_lat), .result(rns_whl_r10_out));
  reg_delay_9L #(.DATA_WIDTH(1)) sign_dly_2 (.pin_name1(clk), .reg_in(sign_dly_1_reg_out), .reg_out(sign2));
  reg_delay_2L #(.DATA_WIDTH(2)) rnd_dly_2 (.clk(clk), .reg_in(rnd_up1_), .reg_out(rnd_up2_));
  ModMultAdd_8L_v2 #(.MODULUS(65536), .DATA_WIDTH(18), .FILE1("modmult_3lut0_d0_m1.hex"), .FILE2("modmult_3lut1_d0_m1.hex"), .FILE3("modmult_3lut2_d0_m1.hex"), .FILE4("partmod_lut_d0_s16_r16.hex")) rns_R1 (
    .clk(clk), .OP_A_mult(reg23_out), .OP_B_add(reg24_out), .result(rns_R1_frac));
  ModMultAdd_8L_v2 #(.MODULUS(78125), .DATA_WIDTH(18), .FILE1("modmult_3lut0_d1_m1.hex"), .FILE2("modmult_3lut1_d1_m1.hex"), .FILE3("modmult_3lut2_d1_m1.hex"), .FILE4("partmod_lut_d1_s16_r16.hex")) rns_R2 (
    .clk(clk), .OP_A_mult(reg25_out), .OP_B_add(reg26_out), .result(rns_R2_frac));
  ModMultAdd_8L_v2 #(.MODULUS(117649), .DATA_WIDTH(18), .FILE1("modmult_3lut0_d2_m1.hex"), .FILE2("modmult_3lut1_d2_m1.hex"), .FILE3("modmult_3lut2_d2_m1.hex"), .FILE4("partmod_lut_d2_s16_r16.hex")) rns_R3 (
    .clk(clk), .OP_A_mult(reg27_out), .OP_B_add(reg28_out), .result(rns_R3_frac));
  ModMultAdd_8L_v2 #(.MODULUS(177147), .DATA_WIDTH(18), .FILE1("modmult_3lut0_d3_m1.hex"), .FILE2("modmult_3lut1_d3_m1.hex"), .FILE3("modmult_3lut2_d3_m1.hex"), .FILE4("partmod_lut_d3_s16_r16.hex")) rns_R4 (
    .clk(clk), .OP_A_mult(reg29_out), .OP_B_add(reg30_out), .result(rns_R4_frac));
  ModMultAdd_8L_v2 #(.MODULUS(262027), .DATA_WIDTH(18), .FILE1("modmult_3lut0_d4_m1.hex"), .FILE2("modmult_3lut1_d4_m1.hex"), .FILE3("modmult_3lut2_d4_m1.hex"), .FILE4("partmod_lut_d4_s16_r16.hex")) rns_R5 (
    .clk(clk), .OP_A_mult(reg31_out), .OP_B_add(reg32_out), .result(rns_R5_frac));
  ModMultAdd_8L_v2 #(.MODULUS(262049), .DATA_WIDTH(18), .FILE1("modmult_3lut0_d5_m1.hex"), .FILE2("modmult_3lut1_d5_m1.hex"), .FILE3("modmult_3lut2_d5_m1.hex"), .FILE4("partmod_lut_d5_s16_r16.hex")) rns_R6 (
    .clk(clk), .OP_A_mult(reg33_out), .OP_B_add(reg34_out), .result(rns_R6_frac));
  ModMultAdd_8L_v2 #(.MODULUS(262051), .DATA_WIDTH(18), .FILE1("modmult_3lut0_d6_m1.hex"), .FILE2("modmult_3lut1_d6_m1.hex"), .FILE3("modmult_3lut2_d6_m1.hex"), .FILE4("partmod_lut_d6_s16_r16.hex")) rns_R7 (
    .clk(clk), .OP_A_mult(reg35_out), .OP_B_add(reg36_out), .result(rns_R7_frac));
  ModMultAdd_8L_v2 #(.MODULUS(262069), .DATA_WIDTH(18), .FILE1("modmult_3lut0_d7_m1.hex"), .FILE2("modmult_3lut1_d7_m1.hex"), .FILE3("modmult_3lut2_d7_m1.hex"), .FILE4("partmod_lut_d7_s16_r16.hex")) rns_R8 (
    .clk(clk), .OP_A_mult(reg37_out), .OP_B_add(reg38_out), .result(rns_R8_frac));
  ModMultAdd_8L_v2 #(.MODULUS(262079), .DATA_WIDTH(18), .FILE1("modmult_3lut0_d8_m1.hex"), .FILE2("modmult_3lut1_d8_m1.hex"), .FILE3("modmult_3lut2_d8_m1.hex"), .FILE4("partmod_lut_d8_s16_r16.hex")) rns_R9 (
    .clk(clk), .OP_A_mult(reg39_out), .OP_B_add(reg40_out), .result(rns_R9_frac));
  ModMultAdd_8L_v2 #(.MODULUS(262103), .DATA_WIDTH(18), .FILE1("modmult_3lut0_d9_m1.hex"), .FILE2("modmult_3lut1_d9_m1.hex"), .FILE3("modmult_3lut2_d9_m1.hex"), .FILE4("partmod_lut_d9_s16_r16.hex")) rns_R10 (
    .clk(clk), .OP_A_mult(reg41_out), .OP_B_add(reg42_out), .result(rns_R10_frac));
  ModMultC18_7L #(.FILE1("multc_3lut0_d2_rf.hex"), .FILE2("multc_3lut1_d2_rf.hex"), .FILE3("multc_3lut2_d2_rf.hex"), .FILE4("partmod_lut_d2_s16_r16.hex"), .MODULUS(117649)) mult_by_rf (
    .clk(clk), .OP_A_mult(rns_whl_r3_out), .result(rns_whl_r3_out_rf));
  ModMultC18_7L #(.FILE1("multc_3lut0_d3_rf.hex"), .FILE2("multc_3lut1_d3_rf.hex"), .FILE3("multc_3lut2_d3_rf.hex"), .FILE4("partmod_lut_d3_s16_r16.hex"), .MODULUS(177147)) mult_by_rf2 (
    .clk(clk), .OP_A_mult(rns_whl_r4_out), .result(rns_whl_r4_out_rf));
  ModMultC18_7L #(.FILE1("multc_3lut0_d4_rf.hex"), .FILE2("multc_3lut1_d4_rf.hex"), .FILE3("multc_3lut2_d4_rf.hex"), .FILE4("partmod_lut_d4_s16_r16.hex"), .MODULUS(262027)) mult_by_rf3 (
    .clk(clk), .OP_A_mult(rns_whl_r5_out), .result(rns_whl_r5_out_rf));
  ModMultC18_7L #(.FILE1("multc_3lut0_d5_rf.hex"), .FILE2("multc_3lut1_d5_rf.hex"), .FILE3("multc_3lut2_d5_rf.hex"), .FILE4("partmod_lut_d5_s16_r16.hex"), .MODULUS(262049)) mult_by_rf4 (
    .clk(clk), .OP_A_mult(rns_whl_r6_out), .result(rns_whl_r6_out_rf));
  ModMultC18_7L #(.FILE1("multc_3lut0_d6_rf.hex"), .FILE2("multc_3lut1_d6_rf.hex"), .FILE3("multc_3lut2_d6_rf.hex"), .FILE4("partmod_lut_d6_s16_r16.hex"), .MODULUS(262051)) mult_by_rf5 (
    .clk(clk), .OP_A_mult(rns_whl_r7_out), .result(rns_whl_r7_out_rf));
  ModMultC18_7L #(.FILE1("multc_3lut0_d7_rf.hex"), .FILE2("multc_3lut1_d7_rf.hex"), .FILE3("multc_3lut2_d7_rf.hex"), .FILE4("partmod_lut_d7_s16_r16.hex"), .MODULUS(262069)) mult_by_rf6 (
    .clk(clk), .OP_A_mult(rns_whl_r8_out), .result(rns_whl_r8_out_rf));
  ModMultC18_7L #(.FILE1("multc_3lut0_d8_rf.hex"), .FILE2("multc_3lut1_d8_rf.hex"), .FILE3("multc_3lut2_d8_rf.hex"), .FILE4("partmod_lut_d8_s16_r16.hex"), .MODULUS(262079)) mult_by_rf7 (
    .clk(clk), .OP_A_mult(rns_whl_r9_out), .result(rns_whl_r9_out_rf));
  ModMultC18_7L #(.FILE1("multc_3lut0_d9_rf.hex"), .FILE2("multc_3lut1_d9_rf.hex"), .FILE3("multc_3lut2_d9_rf.hex"), .FILE4("partmod_lut_d9_s16_r16.hex"), .MODULUS(262103)) mult_by_rf8 (
    .clk(clk), .OP_A_mult(rns_whl_r10_out), .result(rns_whl_r10_out_rf));
  reg_delay_2L #(.DATA_WIDTH(1)) sign_dly_3 (.clk(clk), .reg_in(sign2), .reg_out(sign3));
  ModAddOne_1R_2C #(.DATA_WIDTH(18), .MODULUS(65536)) rns_R1_rnd (
    .clk(clk), .cin(rnd_up2_[15]), .A(rns_R1_frac), .result(rns_R1_round));
  ModAddOne_1R_2C #(.DATA_WIDTH(18), .MODULUS(78125)) rns_R2_rnd (
    .clk(clk), .cin(rnd_up2_[15]), .A(rns_R2_frac), .result(rns_R2_round));
  ModAddcin_1R_2C #(.DATA_WIDTH(18), .MODULUS(117649)) rns_R3_rnd (
    .clk(clk), .cin(rnd_up2_[15]), .A(rns_R3_frac), .B(rns_whl_r3_out_rf), .result(rns_R3_round));
  ModAddcin_1R_2C #(.DATA_WIDTH(18), .MODULUS(177147)) rns_R4_rnd (
    .clk(clk), .cin(rnd_up2_[15]), .A(rns_R4_frac), .B(rns_whl_r4_out_rf), .result(rns_R4_round));
  ModAddcin_1R_2C #(.DATA_WIDTH(18), .MODULUS(262027)) rns_R5_rnd (
    .clk(clk), .cin(rnd_up2_[15]), .A(rns_R5_frac), .B(rns_whl_r5_out_rf), .result(rns_R5_round));
  ModAddcin_1R_2C #(.DATA_WIDTH(18), .MODULUS(262049)) rns_R6_rnd (
    .clk(clk), .cin(rnd_up2_[15]), .A(rns_R6_frac), .B(rns_whl_r6_out_rf), .result(rns_R6_round));
  ModAddcin_1R_2C #(.DATA_WIDTH(18), .MODULUS(262051)) rns_R7_rnd (
    .clk(clk), .cin(rnd_up2_[15]), .A(rns_R7_frac), .B(rns_whl_r7_out_rf), .result(rns_R7_round));
  ModAddcin_1R_2C #(.DATA_WIDTH(18), .MODULUS(262069)) rns_R8_rnd (
    .clk(clk), .cin(rnd_up2_[15]), .A(rns_R8_frac), .B(rns_whl_r8_out_rf), .result(rns_R8_round));
  ModAddcin_1R_2C #(.DATA_WIDTH(18), .MODULUS(262079)) rns_R9_rnd (
    .clk(clk), .cin(rnd_up2_[15]), .A(rns_R9_frac), .B(rns_whl_r9_out_rf), .result(rns_R9_round));
  ModAddcin_1R_2C #(.DATA_WIDTH(18), .MODULUS(262103)) rns_R10_rnd (
    .clk(clk), .cin(rnd_up2_[15]), .A(rns_R10_frac), .B(rns_whl_r10_out_rf), .result(rns_R10_round));
  reg_delay_2L #(.DATA_WIDTH(1)) sign_dly_4 (.clk(clk), .reg_in(sign3), .reg_out(sign_out));
  ModCmpl_1R_2C #(.DATA_WIDTH(18), .MODULUS(65536)) rns_R1_cmpl (
    .clk(clk), .cmpl_ena(sign3), .A(rns_R1_round), .result(rns_R1_out));
  ModCmpl_1R_2C #(.DATA_WIDTH(18), .MODULUS(78125)) rns_R2_cmpl (
    .clk(clk), .cmpl_ena(sign3), .A(rns_R2_round), .result(rns_R2_out));
  ModCmpl_1R_2C #(.DATA_WIDTH(18), .MODULUS(117649)) rns_R3_cmpl (
    .clk(clk), .cmpl_ena(sign3), .A(rns_R3_round), .result(rns_R3_out));
  ModCmpl_1R_2C #(.DATA_WIDTH(18), .MODULUS(177147)) rns_R4_cmpl (
    .clk(clk), .cmpl_ena(sign3), .A(rns_R4_round), .result(rns_R4_out));
  ModCmpl_1R_2C #(.DATA_WIDTH(18), .MODULUS(262027)) rns_R5_cmpl (
    .clk(clk), .cmpl_ena(sign3), .A(rns_R5_round), .result(rns_R5_out));
  ModCmpl_1R_2C #(.DATA_WIDTH(18), .MODULUS(262049)) rns_R6_cmpl (
    .clk(clk), .cmpl_ena(sign3), .A(rns_R6_round), .result(rns_R6_out));
  ModCmpl_1R_2C #(.DATA_WIDTH(18), .MODULUS(262051)) rns_R7_cmpl (
    .clk(clk), .cmpl_ena(sign3), .A(rns_R7_round), .result(rns_R7_out));
  ModCmpl_1R_2C #(.DATA_WIDTH(18), .MODULUS(262069)) rns_R8_cmpl (
    .clk(clk), .cmpl_ena(sign3), .A(rns_R8_round), .result(rns_R8_out));
  ModCmpl_1R_2C #(.DATA_WIDTH(18), .MODULUS(262079)) rns_R9_cmpl (
    .clk(clk), .cmpl_ena(sign3), .A(rns_R9_round), .result(rns_R9_out));
  ModCmpl_1R_2C #(.DATA_WIDTH(18), .MODULUS(262103)) rns_R10_cmpl (
    .clk(clk), .cmpl_ena(sign3), .A(rns_R10_round), .result(rns_R10_out));

  // Other names for the same wires on the sheet: R3_in_[15:0] = R3_in; R4_in_[15:0] = R4_in

  // Notes on the sheet:
  //   Complete forward fixed-point converter, pipelined.
  //   This design can be radically improved by many different optimizations
  //   No properties at this time due to the custom nature of conversion units
  //   Modulus: 65536, 78125, 117649, 177147, 262027, 262049, 262051, 262069, 262079, 262103
  //   The round-up should be an increment of two, not one.
  //   The single range modular adders will not work in this case.
  //   NEED TO UPGRADE LATER
endmodule
